# Altium schematic sheet usb.SchDoc
size A4
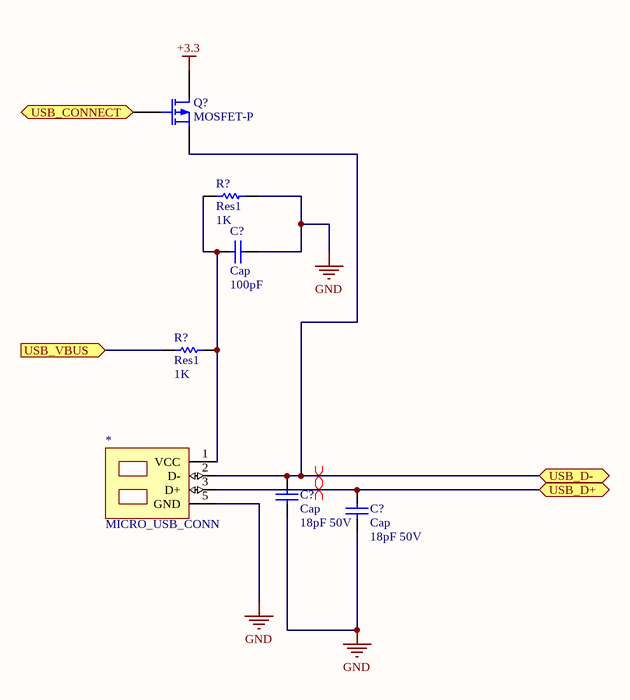
[diagram p0: usb.SchDoc]

## Parts
(Parts that share a designator on the sheet are numbered #1, #2 ... from top to bottom, then left to right.)
*  MICRO_USB_CONN  [USB_MICRO_CONNECTOR]
C?#1  Cap  value 100pF  [RAD-0.3]
C?#2  Cap  value 18pF 50V  [RAD-0.3]
C?#3  Cap  value 18pF 50V  [RAD-0.3]
Q?  MOSFET-P  [BCY-W3/B.8]
R?#1  Res1  value 1K  [AXIAL-0.3]
R?#2  Res1  value 1K  [AXIAL-0.3]

## Ports
USB_CONNECT (out), USB_D+ (bidir), USB_D- (bidir), USB_VBUS (in)

## Nets
+3.3: Q?.1(D)
GND: *.5(GND) C?#1.2 C?#2.1 C?#3.1 R?#1.2
USB_CONNECT: Q?.2(G) ; port USB_CONNECT
USB_D+: *.3(D+) C?#3.2 ; port USB_D+
USB_D-: *.2(D-) C?#2.2 Q?.3(S) ; port USB_D-
USB_VBUS: R?#2.2 ; port USB_VBUS
Net*_1: *.1(VCC) C?#1.1 R?#1.1 R?#2.1

## Layout directives
differential pair: USB_D+, USB_D-

## Library data of the parts
* = MICRO_USB_CONN: MOLEX - 47346-0001 - RECEPTACLE, MICRO USB B, BOTTOM MOUNT; farnell: 1568026
C?#1-C?#3 = Cap: Capacitor; Published: 8-Jun-2000; LatestRevisionDate: 17-Jul-2002; LatestRevisionNote: Re-released for DXP Platform.; PackageReference: RAD-0.3; Publisher: Altium Limited
Q? = MOSFET-P: P-Channel MOSFET; Published: 8-Jun-2000; LatestRevisionDate: 17-Jul-2002; LatestRevisionNote: Re-released for DXP Platform.; PackageVersion: 1995/1996; PackageReference: E3; Publisher: Altium Limited
R?#1 R?#2 = Res1: Resistor; Published: 8-Jun-2000; LatestRevisionDate: 17-Jul-2002; LatestRevisionNote: Re-released for DXP Platform.; PackageReference: AXIAL-0.3; Publisher: Altium Limited